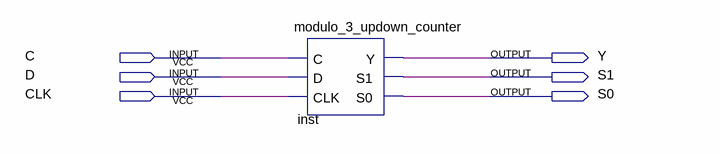
[diagram p0: schematic sheet]
// Quartus schematic TOP.bdf as structural Verilog: 1 symbols, 6 pins
module TOP (
  input  C,
  input  D,
  input  CLK,
  output Y,
  output S1,
  output S0
);

  modulo_3_updown_counter inst (.C(C), .D(D), .CLK(CLK), .Y(Y), .S1(S1), .S0(S0));
endmodule
